# EAGLE design touchpad_brk (EAGLE 9.0.1)
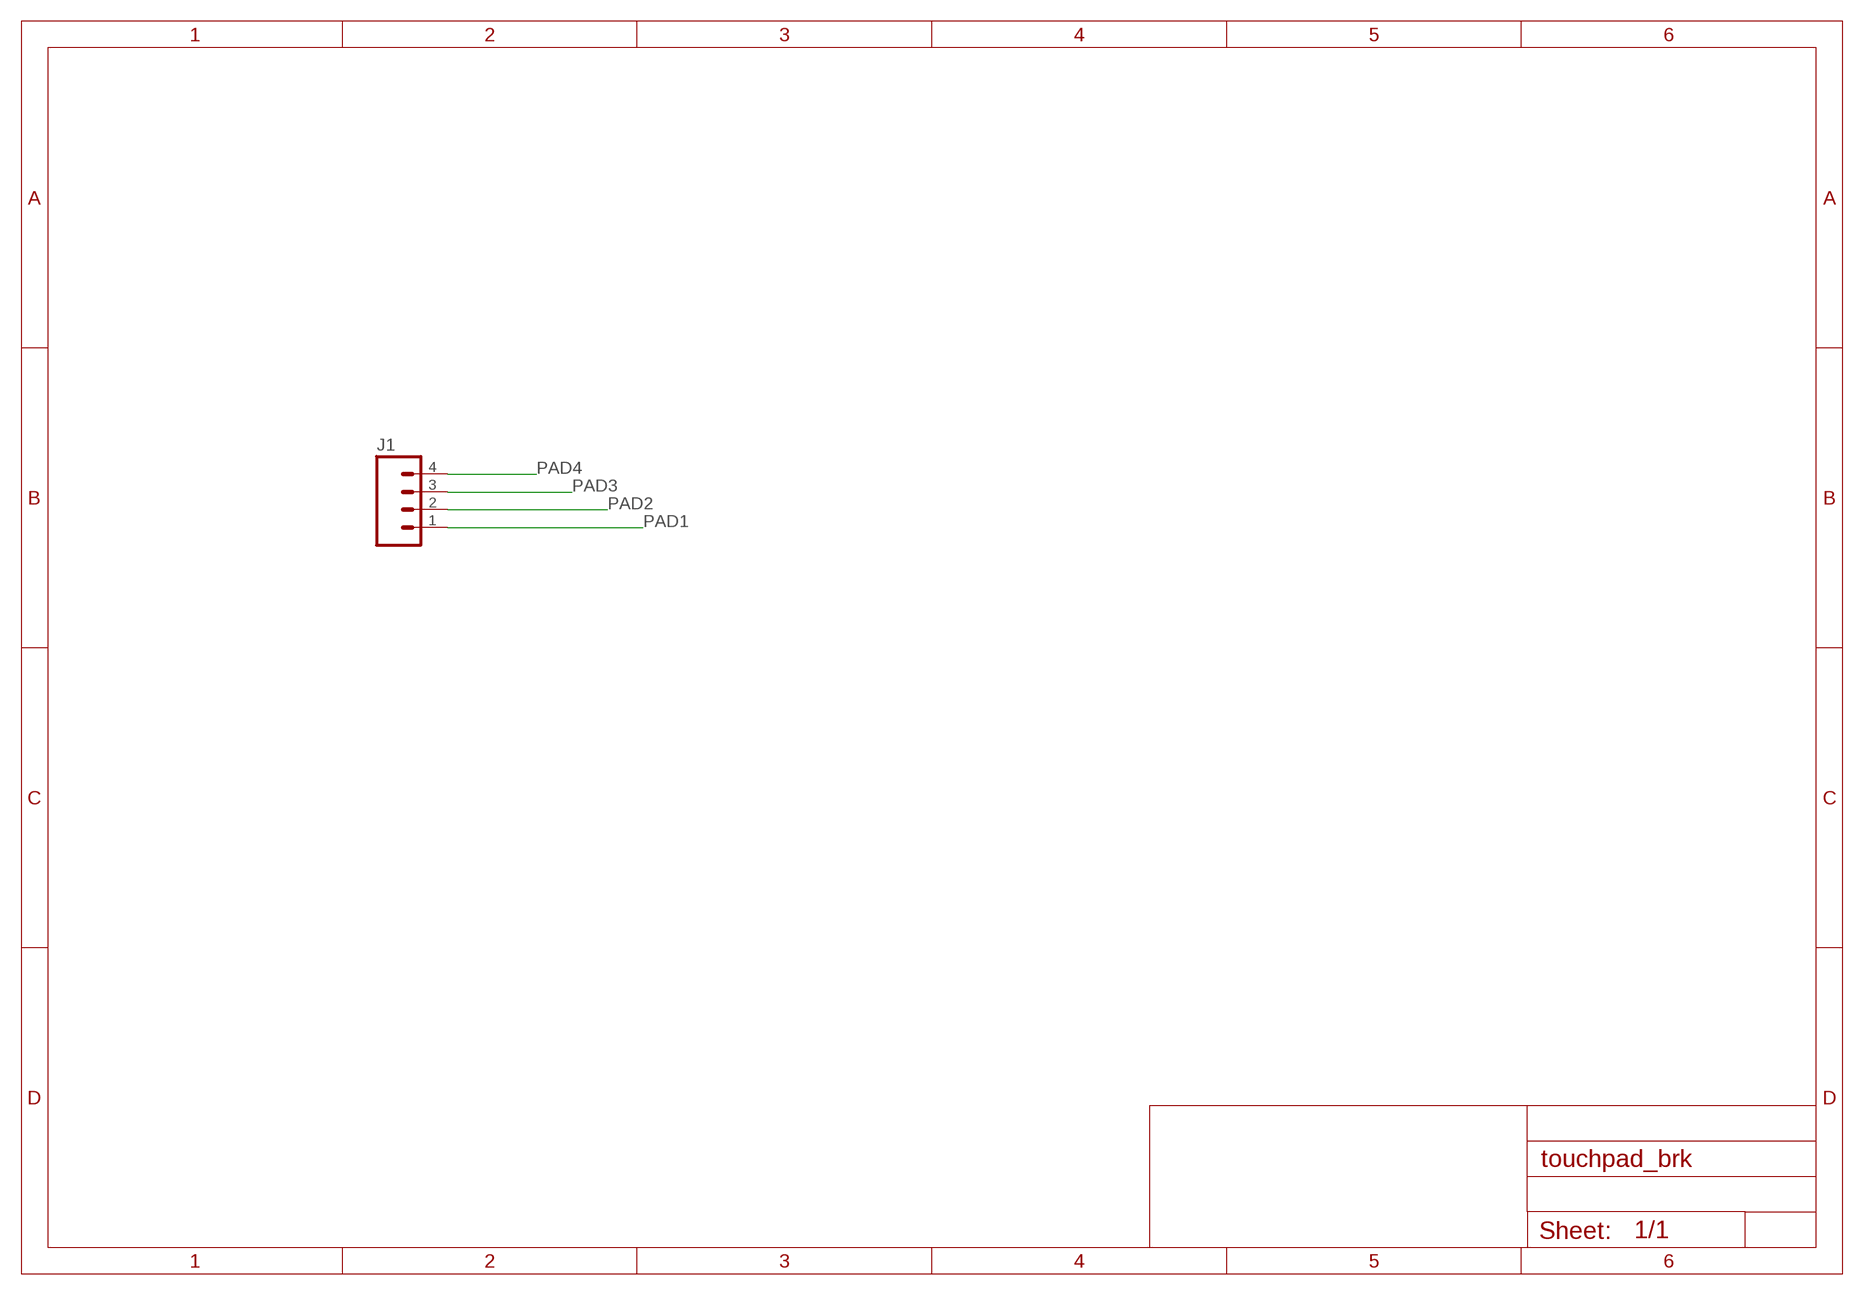
[diagram p0: schematic, sheet 1]

## Parts
J1  M04PTH  [1X04]

## Nets
PAD1: J1.1
PAD2: J1.2
PAD3: J1.3
PAD4: J1.4

## Library data of the parts
J1 = SparkFun-Connectors:M04: Header 4 Standard 4-pin 0.1" header. Use with straight break away headers (SKU : PRT-00116), right angle break away headers (PRT-00553), swiss pins (PRT-00743), machine pins (PRT-00117), and female headers (PRT-00115). Molex polarized connector foot print use with SKU : PRT-08231 with associated crimp pins and housings. 1MM SMD Version SKU: PRT-10208; PROD_ID: CONN-09696

## Board
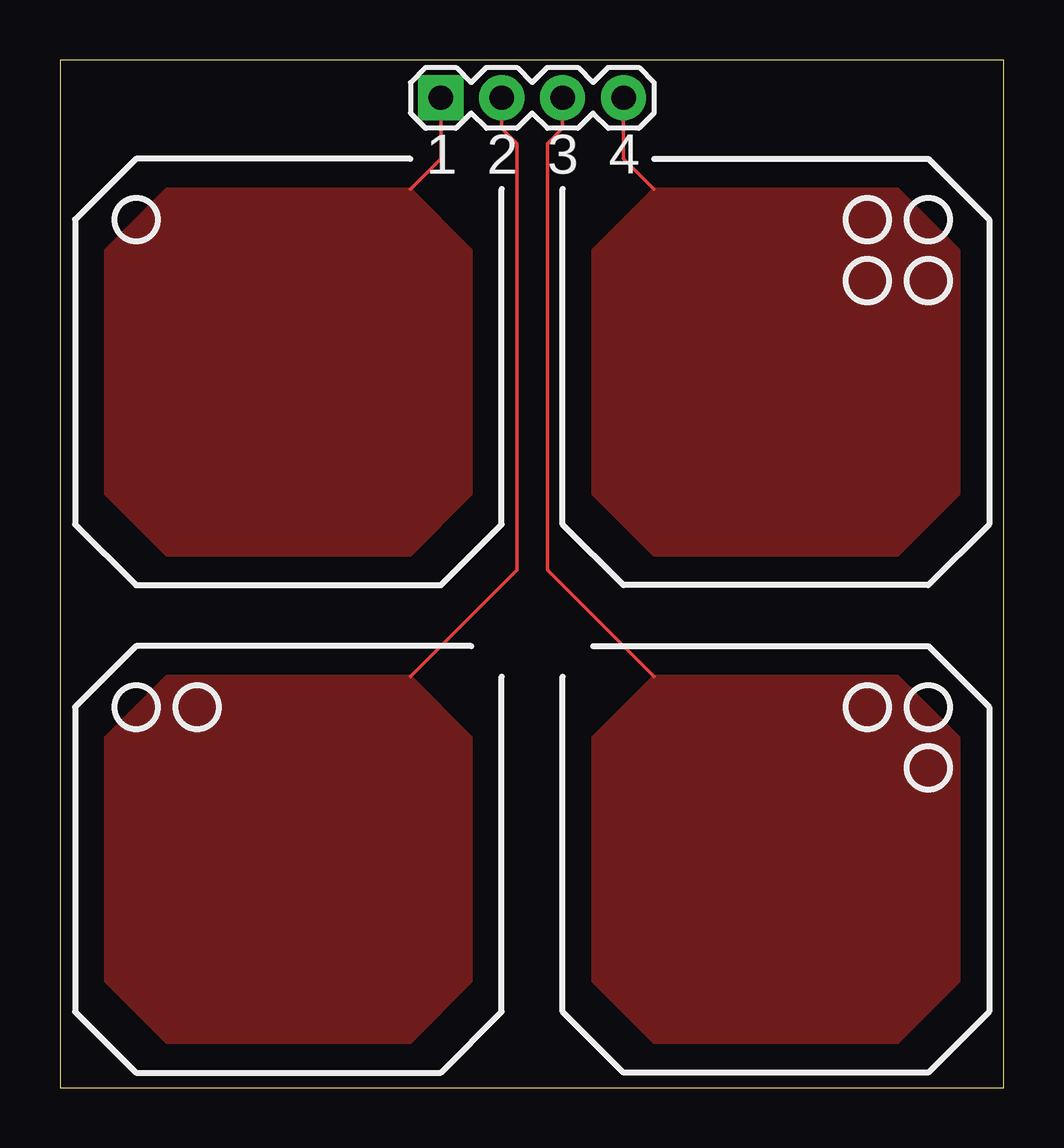
[diagram p1: board, top side]

Size 39.35 x 42.85 mm. Coordinates in mm from the lower left corner, seen from the top.
Outline: 0,0 39.35,0 39.35,42.85 0,42.85 0,0
Copper layers (1*16): Top 0.0356mm / dielectric 1.5011mm / Bottom 0.0356mm
Design rules "Laen OSH Park PCBOrder": minimum track width 6mil, minimum drill 13mil, track to track 6mil, track to pad 6mil, pad to pad 6mil, via to via 6mil, smd to smd 6mil, copper to edge 15mil, drill to drill 6mil, minimum pad ring 7mil, minimum via ring 7mil, stop-mask expansion 3mil, vias tented up to drill 0mil, thermal gap 10mil

### Footprints (pad centres in the part's own frame; a part is rotated, then mirrored left to right if it is on the bottom)
1X04 = drill 1.016 pad 1.88 square: 1 0,0 | drill 1.016 pad 1.88: 2 2.54,0; 3 5.08,0; 4 7.62,0

### Placement (x,y rotation side)
J1  15.88,41.27 0 top

### Tracks (layer width: path | path; a pad name or v marks a point on that pad's centre or on a via)
PAD1
  Top 0.152: J1.1 15.88,38.73 14.61,37.46
  pour Top: 4.44,37.46 1.91,34.92 1.91,24.77 4.44,22.22 14.61,22.22 17.14,24.77 17.14,34.92 14.61,37.46
PAD2
  Top 0.152: J1.2 18.41,40 19.05,39.37 19.05,21.59 14.61,17.14
  pour Top: 4.44,17.14 1.91,14.61 1.91,4.44 4.44,1.91 14.61,1.91 17.14,4.44 17.14,14.61 14.61,17.14
PAD3
  Top 0.152: J1.3 20.95,40 20.32,39.37 20.32,21.59 24.77,17.14
  pour Top: 24.77,17.14 22.22,14.61 22.22,4.44 24.77,1.91 34.92,1.91 37.46,4.44 37.46,14.61 34.92,17.14
PAD4
  Top 0.152: J1.4 23.49,38.73 24.77,37.46
  pour Top: 24.77,37.46 22.22,34.92 22.22,24.77 24.77,22.22 34.92,22.22 37.46,24.77 37.46,34.92 34.92,37.46

### Text on the board
tNames: 1 | 2 | 3 | 4
bNames: ** Toucb pad / ** test breakout